# EasyEDA Pro project 单转双芯片.eprj

# Schematic Schematic1
Create Date: 2023-07-18; Page Name: P1; Project Name: 单转双芯片; Schematic Name: Schematic1; Update Date: 2023-07-19; Company: 嘉立创EDA; Page Size: A4; Version: V1.0
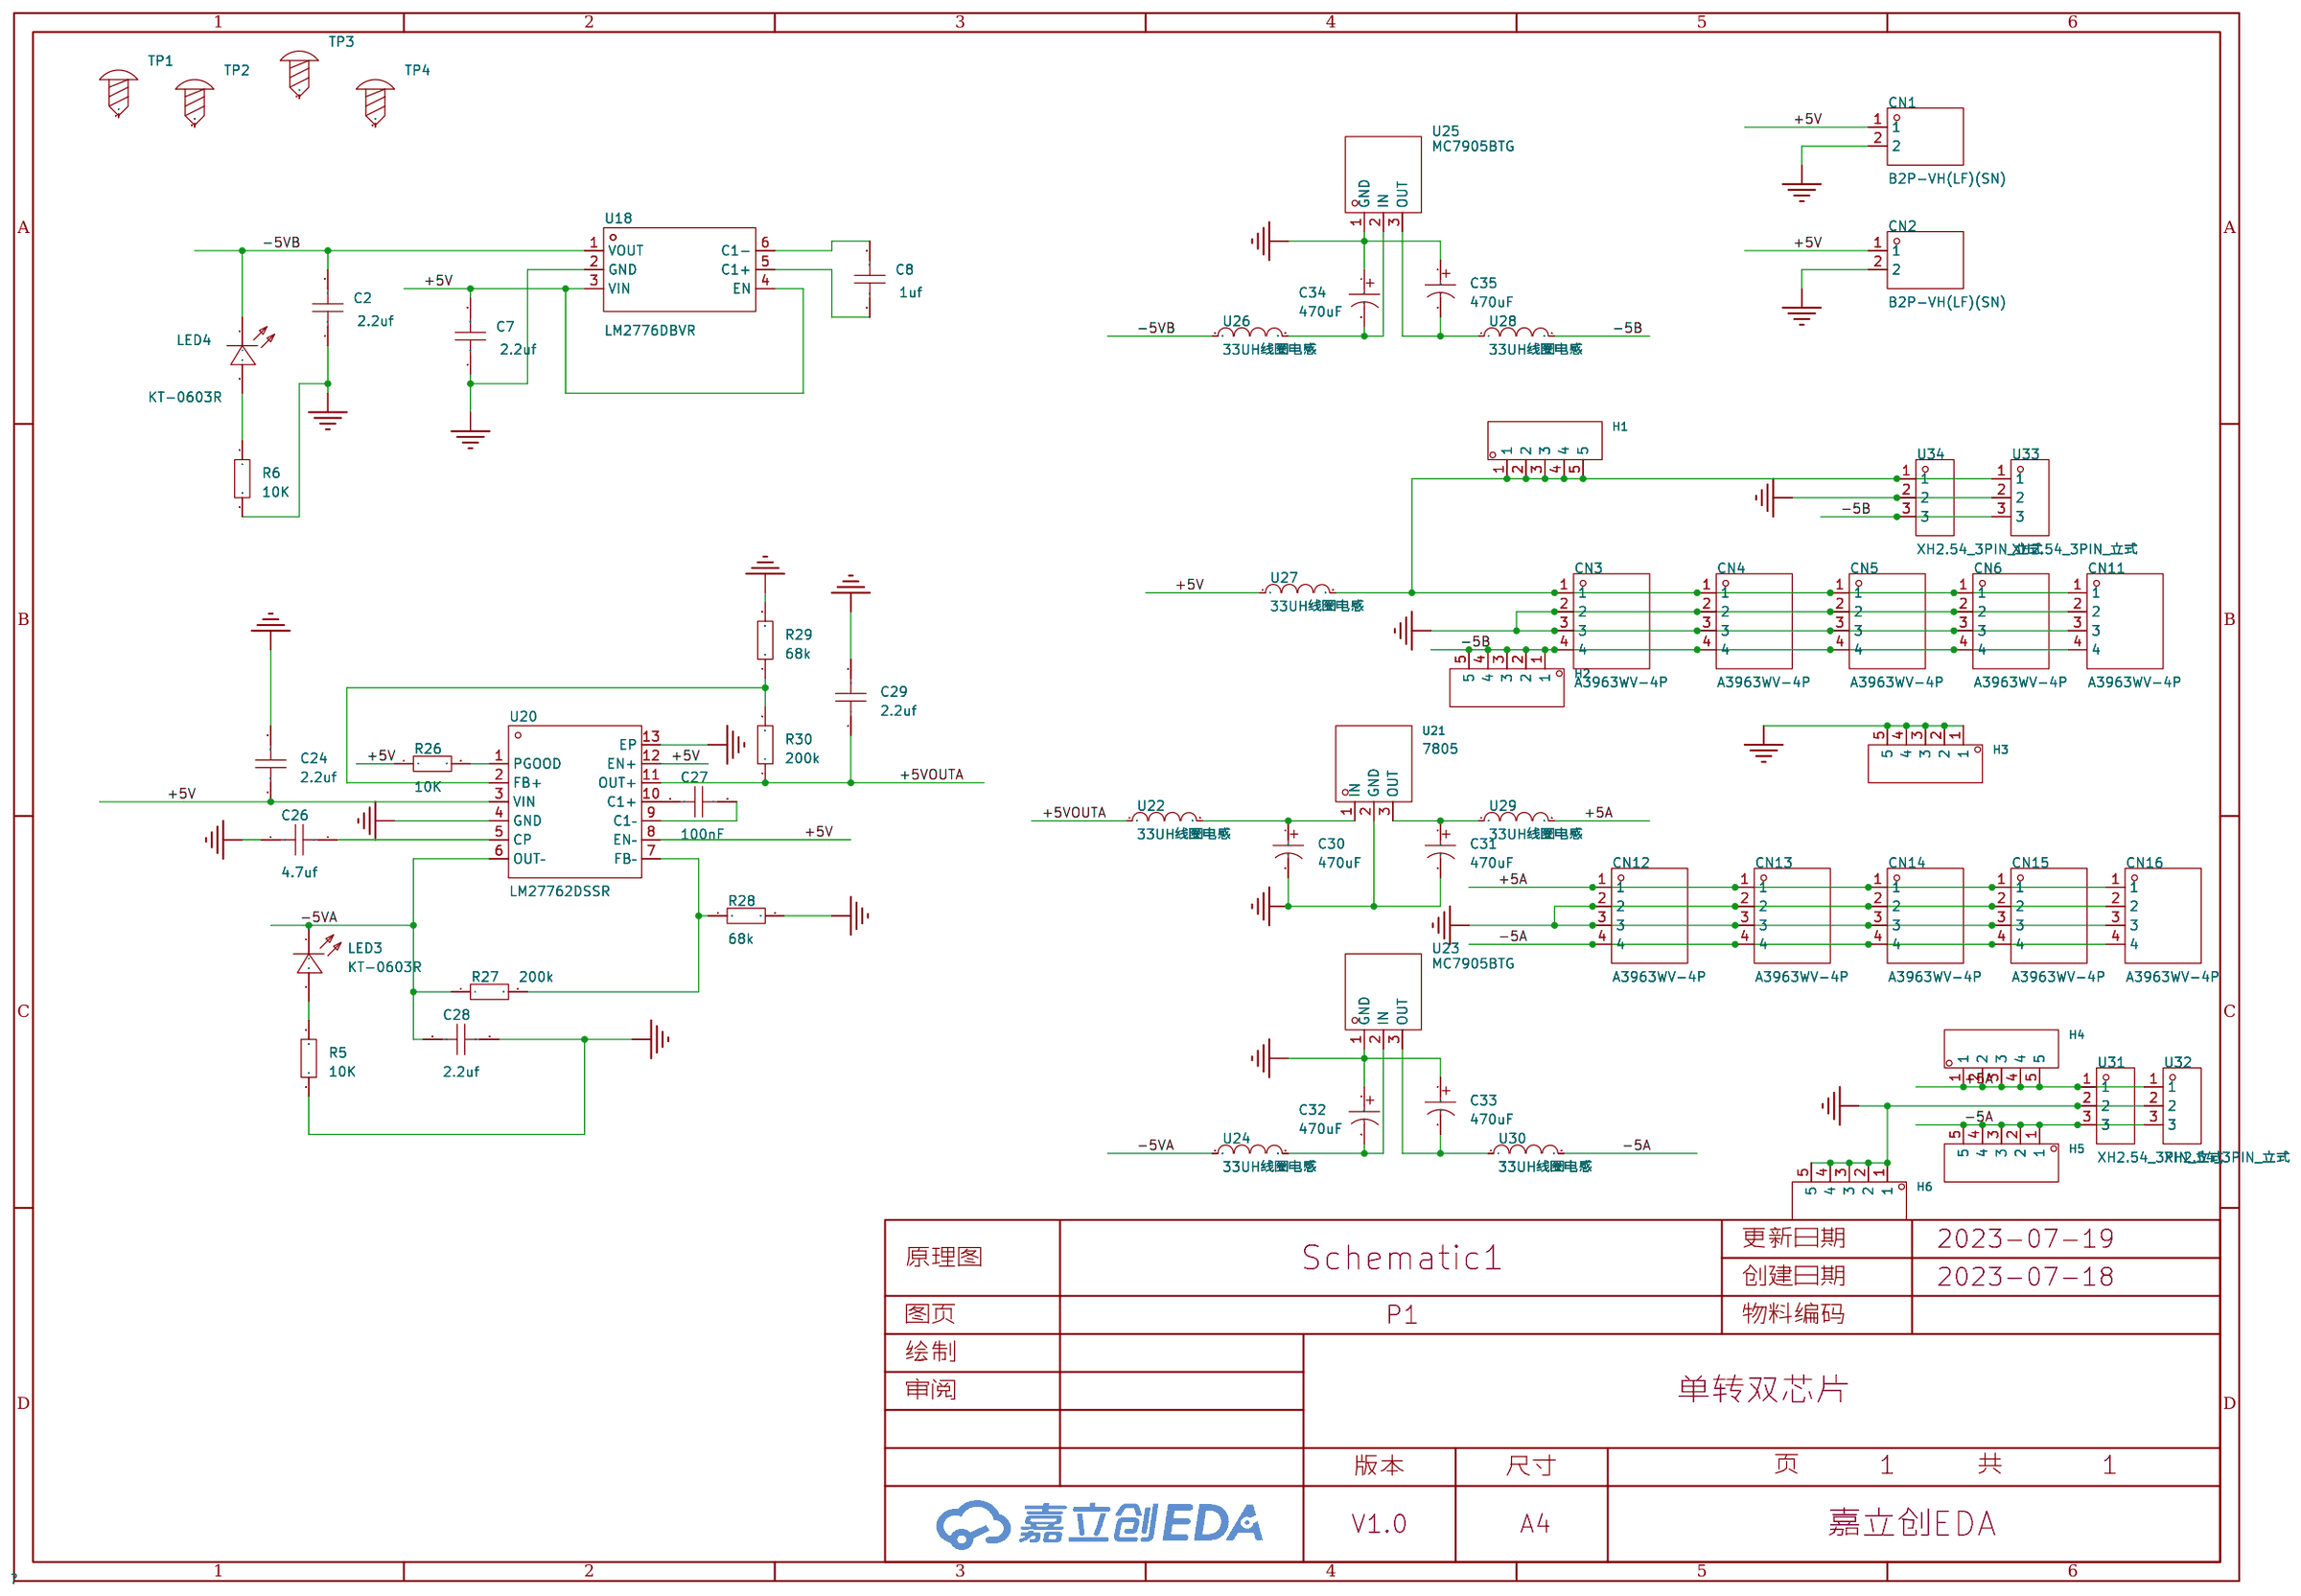
[diagram p0: schematic sheet]

## Parts
C2  2.2uf  [C0603]
C7  2.2uf  [C0603]
C8  1uf  [C0603]
C24  2.2uf  [C0603]
C26  4.7uf  [C0603]
C27  100nF  [C0603]
C28  2.2uf  [C0603]
C29  2.2uf  [C0603]
C30  470uF  [CAP-TH_BD8.0-P3.50-D0.6-FD]
C31  470uF  [CAP-TH_BD8.0-P3.50-D0.6-FD]
C32  470uF  [CAP-TH_BD8.0-P3.50-D0.6-FD]
C33  470uF  [CAP-TH_BD8.0-P3.50-D0.6-FD]
C34  470uF  [CAP-TH_BD8.0-P3.50-D0.6-FD]
C35  470uF  [CAP-TH_BD8.0-P3.50-D0.6-FD]
CN1  B2P-VH(LF)(SN)  [CONN-TH_B2P-VH-LF-SN]
CN2  B2P-VH(LF)(SN)  [CONN-TH_B2P-VH-LF-SN]
CN3  A3963WV-4P  [CONN-TH_A3963WV-4P]
CN4  A3963WV-4P  [CONN-TH_A3963WV-4P]
CN5  A3963WV-4P  [CONN-TH_A3963WV-4P]
CN6  A3963WV-4P  [CONN-TH_A3963WV-4P]
CN11  A3963WV-4P  [CONN-TH_A3963WV-4P]
CN12  A3963WV-4P  [CONN-TH_A3963WV-4P]
CN13  A3963WV-4P  [CONN-TH_A3963WV-4P]
CN14  A3963WV-4P  [CONN-TH_A3963WV-4P]
CN15  A3963WV-4P  [CONN-TH_A3963WV-4P]
CN16  A3963WV-4P  [CONN-TH_A3963WV-4P]
H1  -  [HDR-TH_5P-P2.54-V-M]
H2  -  [HDR-TH_5P-P2.54-V-M]
H3  -  [HDR-TH_5P-P2.54-V-M]
H4  -  [HDR-TH_5P-P2.54-V-M]
H5  -  [HDR-TH_5P-P2.54-V-M]
H6  -  [HDR-TH_5P-P2.54-V-M]
LED3  KT-0603R  [LED0603-RD]
LED4  KT-0603R  [LED0603-RD]
R5  10K  [R0603]
R6  10K  [R0603]
R26  10K  [R0603]
R27  200k  [R0603]
R28  68k  [R0603]
R29  68k  [R0603]
R30  200k  [R0603]
TP1  -  [M3螺丝]
TP2  -  [M3螺丝]
TP3  -  [M3螺丝]
TP4  -  [M3螺丝]
U18  LM2776DBVR  [SOT-23-6_L2.9-W1.6-P0.95-LS2.8-BR]
U20  LM27762DSSR  [WSON-12_L3.0-W2.0-P0.50-BL-EP]
U21  7805  [TO-220-3_L10.2-W4.5-P2.54-L-1]
U22  33UH线圈电感  [IND-TH_L5.4-W5.0]
U23  MC7905BTG  [TO-220-3_L10.0-W4.5-P2.54-T]
U24  33UH线圈电感  [IND-TH_L5.4-W5.0]
U25  MC7905BTG  [TO-220-3_L10.0-W4.5-P2.54-T]
U26  33UH线圈电感  [IND-TH_L5.4-W5.0]
U27  33UH线圈电感  [IND-TH_L5.4-W5.0]
U28  33UH线圈电感  [IND-TH_L5.4-W5.0]
U29  33UH线圈电感  [IND-TH_L5.4-W5.0]
U30  33UH线圈电感  [IND-TH_L5.4-W5.0]
U31  XH2.54_3PIN_立式  [CONN-TH_XH2.54_3PIN]
U32  XH2.54_3PIN_立式  [CONN-TH_XH2.54_3PIN]
U33  XH2.54_3PIN_立式  [CONN-TH_XH2.54_3PIN]
U34  XH2.54_3PIN_立式  [CONN-TH_XH2.54_3PIN]

## Library data of the parts
C2 C7 C8 C24 C26-C29 = CAP_0603: Supplier Footprint: 0603
C30-C35 = 470uF 25V 8*12: 容值:470uF;精度:±20%;额定电压:25V;; LCSC Part Name: 470uF ±20% 25V; Supplier Part: C43839; Manufacturer: CX(承兴); Manufacturer Part: KM477M025F12RR0VH2FP0; Supplier Footprint: 插件,D8xL12mm; JLCPCB Part Class: Extended Part; Datasheet: https://atta.szlcsc.com/upload/public/pdf/source/20211027/06D6BA3719C264B639DC286D935D03EA.pdf; Supplier: LCSC; Tolerance: ±20%; Rated Voltage: 25V; φD: 8mm; L: 12mm; Lead Spacing: 3.5mm; Lifetime @ Temp: 2000hrs@105℃
CN1 CN2 = B2P-VH(LF)(SN): 参考系列:VH;间距:3.96mm;插针结构:1x2P;排数:1;每排PIN数:2;行距:-;安装方式:-;触头材质:黄铜;; LCSC Part Name: VH 3.96mm 1x2P 直插; Supplier Part: C160315; Manufacturer: JST; Supplier Footprint: 插件,P=3.96mm; JLCPCB Part Class: 扩展库; Datasheet: https://atta.szlcsc.com/upload/public/pdf/source/20180420/C160315_19C451141449BB9E1CAF8D49BAD03192.pdf; Supplier: LCSC; Reference Series: VH; Pitch: 3.96mm; Pins Structure: 1x2P; Number of Rows: 1; Number of PINs Per Row: 2; Contact Material: 黄铜
CN3-CN6 CN11-CN16 = A3963WV-4P: 参考系列:VH;间距:3.96mm;插针结构:1x4P;排数:1;每排PIN数:4;行距:-;安装方式:-;触头材质:黄铜;; LCSC Part Name: VH 3.96mm 1x4P; Supplier Part: C239411; Manufacturer: CJT(长江连接器); Supplier Footprint: 直插,P=3.96mm; JLCPCB Part Class: Extended Part; Datasheet: https://atta.szlcsc.com/upload/public/pdf/source/20180725/C239411_2B583D17F8A06D9E72A993AEB9CC7416.pdf; Supplier: LCSC; Reference Series: VH; Pitch: 3.96mm; Pins Structure: 1x4P; Number of Rows: 1; Number of PINs Per Row: 4; Contact Material: 黄铜
H1-H6 = HDR-M_2.54_1x5P: Supplier Part: C358687; Supplier Footprint: 插件
LED3 LED4 = KT-0603R: 发光颜色:红灯;二极管配置:-;透镜颜色:-;主波长:-;色温:-;功率:-;发光角度:-;安装方式:-;工作温度:-40℃~+85℃;; LCSC Part Name: 0603 红灯 高亮; Supplier Part: C2286; Manufacturer: KENTO; Supplier Footprint: 0603; JLCPCB Part Class: 基础库; Datasheet: https://atta.szlcsc.com/upload/public/pdf/source/20160616/1466072038404.pdf; Supplier: LCSC; Emitted Color: 红灯; Operating Temperature: -40℃~+85℃
R5 R6 R26-R30 = Res_0603: Supplier Footprint: 0603
TP1-TP4 = M3螺丝: Supplier Footprint: 插件
U18 = LM2776DBVR: 可输出电流:200mA;开关工作频率:2MHz;输出类型:Fixed;输出电压的路数:1;功能类型:Ratiometric;输出配置:Negative;; Supplier Part: C69527; Manufacturer: TI(德州仪器); Supplier Footprint: SOT-23-6; JLCPCB Part Class: Extended Part; Datasheet: https://atta.szlcsc.com/upload/public/pdf/source/20170908/C69527_1504870089399958035.pdf; Supplier: LCSC
U20 = LM27762DSSR: 功能类型:电荷泵;同步整流:否;输出通道数:2;拓扑结构:-;输入电压:2.7V~5.5V;输出电压:-5V~-1.5V；1.5V~5V;输出电流(最大值):250mA;开关频率:2.3MHz;; LCSC Part Name: 电荷泵 Vin=2.7V~5.5V Vout=1.5V~5V Vout=-5V~-1.5V 250mA; Supplier Part: C473398; Manufacturer: TI(德州仪器); Supplier Footprint: WSON-12; JLCPCB Part Class: 扩展库; Datasheet: https://atta.szlcsc.com/upload/public/pdf/source/20200102/C473398_D2E7C41775171187D808CA6E0151F4D2.pdf; Supplier: LCSC; Function: 电荷泵; Synchronous Rectification: 否; Number of Outputs: 2; Input Voltage: 2.7V~5.5V; Output Voltage: -5V~-1.5V；1.5V~5V; Output Current (Max): 250mA; Switching Frequency: 2.3MHz
U21 = 7805: 输出类型:固定;输出极性:正;最大输入电压:35V;输出电压:5V;输出电流:1.5A;电源纹波抑制比(PSRR):62dB@(120Hz);; LCSC Part Name: 输入35V 输出5V 1.5A; Supplier Part: C4944936; Manufacturer: SY(顺烨）; Supplier Footprint: TO-220AB; JLCPCB Part Class: 扩展库; Datasheet: https://atta.szlcsc.com/upload/public/pdf/source/20220719/323A3F14557C229271C454C7C0F759A5.pdf; Supplier: LCSC; Output Type: 固定; Output Polarity: 正; Maximum Input Voltage: 35V; Output Voltage: 5V; Output Current: 1.5A; Power Supply Rejection Ratio (PSRR): 62dB@(120Hz)
U22 U24 U26-U30 = 33UH线圈电感: Supplier Part: C9900014722; Supplier Footprint: DIP-LH-2P-12*6MM; JLCPCB Part Class: 扩展库; Datasheet: https://atta.szlcsc.comnull; Supplier: LCSC
U23 U25 = MC7905BTG: 输出类型:固定;输出极性:负;最大输入电压:35V;输出电压:5V;输出电流:1A;电源纹波抑制比(PSRR):70dB@(120Hz);; LCSC Part Name: 输入35V 输出5V 1A; Supplier Part: C153066; Manufacturer: onsemi(安森美); Supplier Footprint: TO-220; JLCPCB Part Class: 扩展库; Datasheet: https://atta.szlcsc.com/upload/public/pdf/source/20171221/C153066_15138394766691195791.PDF; Supplier: LCSC; Output Type: 固定; Output Polarity: 负; Number of Outputs: 1; Maximum Input Voltage: 35V; Output Voltage: 5V; Dropout Voltage: 1.3V@(1A); Output Current: 1A; Power Supply Rejection Ratio (PSRR): 70dB@(120Hz); Operating Temperature: -40℃~+125℃
U31-U34 = XH2.54_3PIN_立式: Supplier Part: C9900001961; Supplier Footprint: CONN-TH_3P-P2.54-L10.0-W5.8; JLCPCB Part Class: 扩展库; Datasheet: 2021-11-15/732541S/0c8180f3a8954d56be60ffcaf2ae9190/MAX6071_cn.pdf; Supplier: LCSC

## Nets
+5V: C7.2 C24.1 CN1.1 CN2.1 R26.1 U18.3(VIN) U18.4(EN) U20.3(VIN) U20.8(EN–) U20.12(EN+) U27.1
+5VOUTA: C29.1 R30.1 U20.11(OUT+) U22.1
-5VA: C28.2 LED3.1(K) R27.1 U20.6(OUT–) U24.1
-5VB: C2.2 LED4.1(K) U18.1(VOUT) U26.1
GND: C2.1 C7.1 C24.2 C26.2 C28.1 C29.2 C30.2 C31.2 C32.1 C33.1 C34.1 C35.1 CN1.2 CN2.2 CN3.2 CN3.3 CN4.2 CN4.3 CN5.2 CN5.3 CN6.2 CN6.3 CN11.2 CN11.3 CN12.2 CN12.3 CN13.2 CN13.3 CN14.2 CN14.3 CN15.2 CN15.3 CN16.2 CN16.3 H3.1 H3.2 H3.3 H3.4 H3.5 H6.1 H6.2 H6.3 H6.4 H6.5 R5.2 R6.2 R28.2 R29.2 U18.2(GND) U20.4(GND) U20.13(EP) U21.2(GND) U23.1(GND) U25.1(GND) U31.2 U32.2 U33.2 U34.2
+5A: CN12.1 CN13.1 CN14.1 CN15.1 CN16.1 H4.1 H4.2 H4.3 H4.4 H4.5 U29.2 U31.1 U32.1
-5A: CN12.4 CN13.4 CN14.4 CN15.4 CN16.4 H5.1 H5.2 H5.3 H5.4 H5.5 U30.2 U31.3 U32.3
-5B: CN3.4 CN4.4 CN5.4 CN6.4 CN11.4 H2.1 H2.2 H2.3 H2.4 H2.5 U28.2 U33.3 U34.3
$1N236: C8.1 U18.5(C1+)
$1N237: C8.2 U18.6(C1-)
$1N242: LED4.2(A) R6.1
$1N715: C26.1 U20.5(CP)
$1N716: C27.1 U20.10(C1+)
$1N717: C27.2 U20.9(C1–)
$1N728: R29.1 R30.2 U20.2(FB+)
$1N729: R26.2 U20.1(PGOOD)
$1N734: R27.2 R28.1 U20.7(FB–)
$1N740: LED3.2(A) R5.1
$1N844: C30.1 U21.1(IN) U22.2
$1N1353: C32.2 U23.2(IN) U24.2
$1N1533: C34.2 U25.2(IN) U26.2
$1N3122: C35.2 U25.3(OUT) U28.1
$1N3165: C31.1 U21.3(OUT) U29.1
$1N3204: C33.2 U23.3(OUT) U30.1
Net-(CN3-1): CN3.1 CN4.1 CN5.1 CN6.1 CN11.1 H1.1 H1.2 H1.3 H1.4 H1.5 U27.2 U33.1 U34.1

Not connected (* = marked no-connect by the designer): TP1 1; TP2 1; TP3 1; TP4 1

# Board PCB1
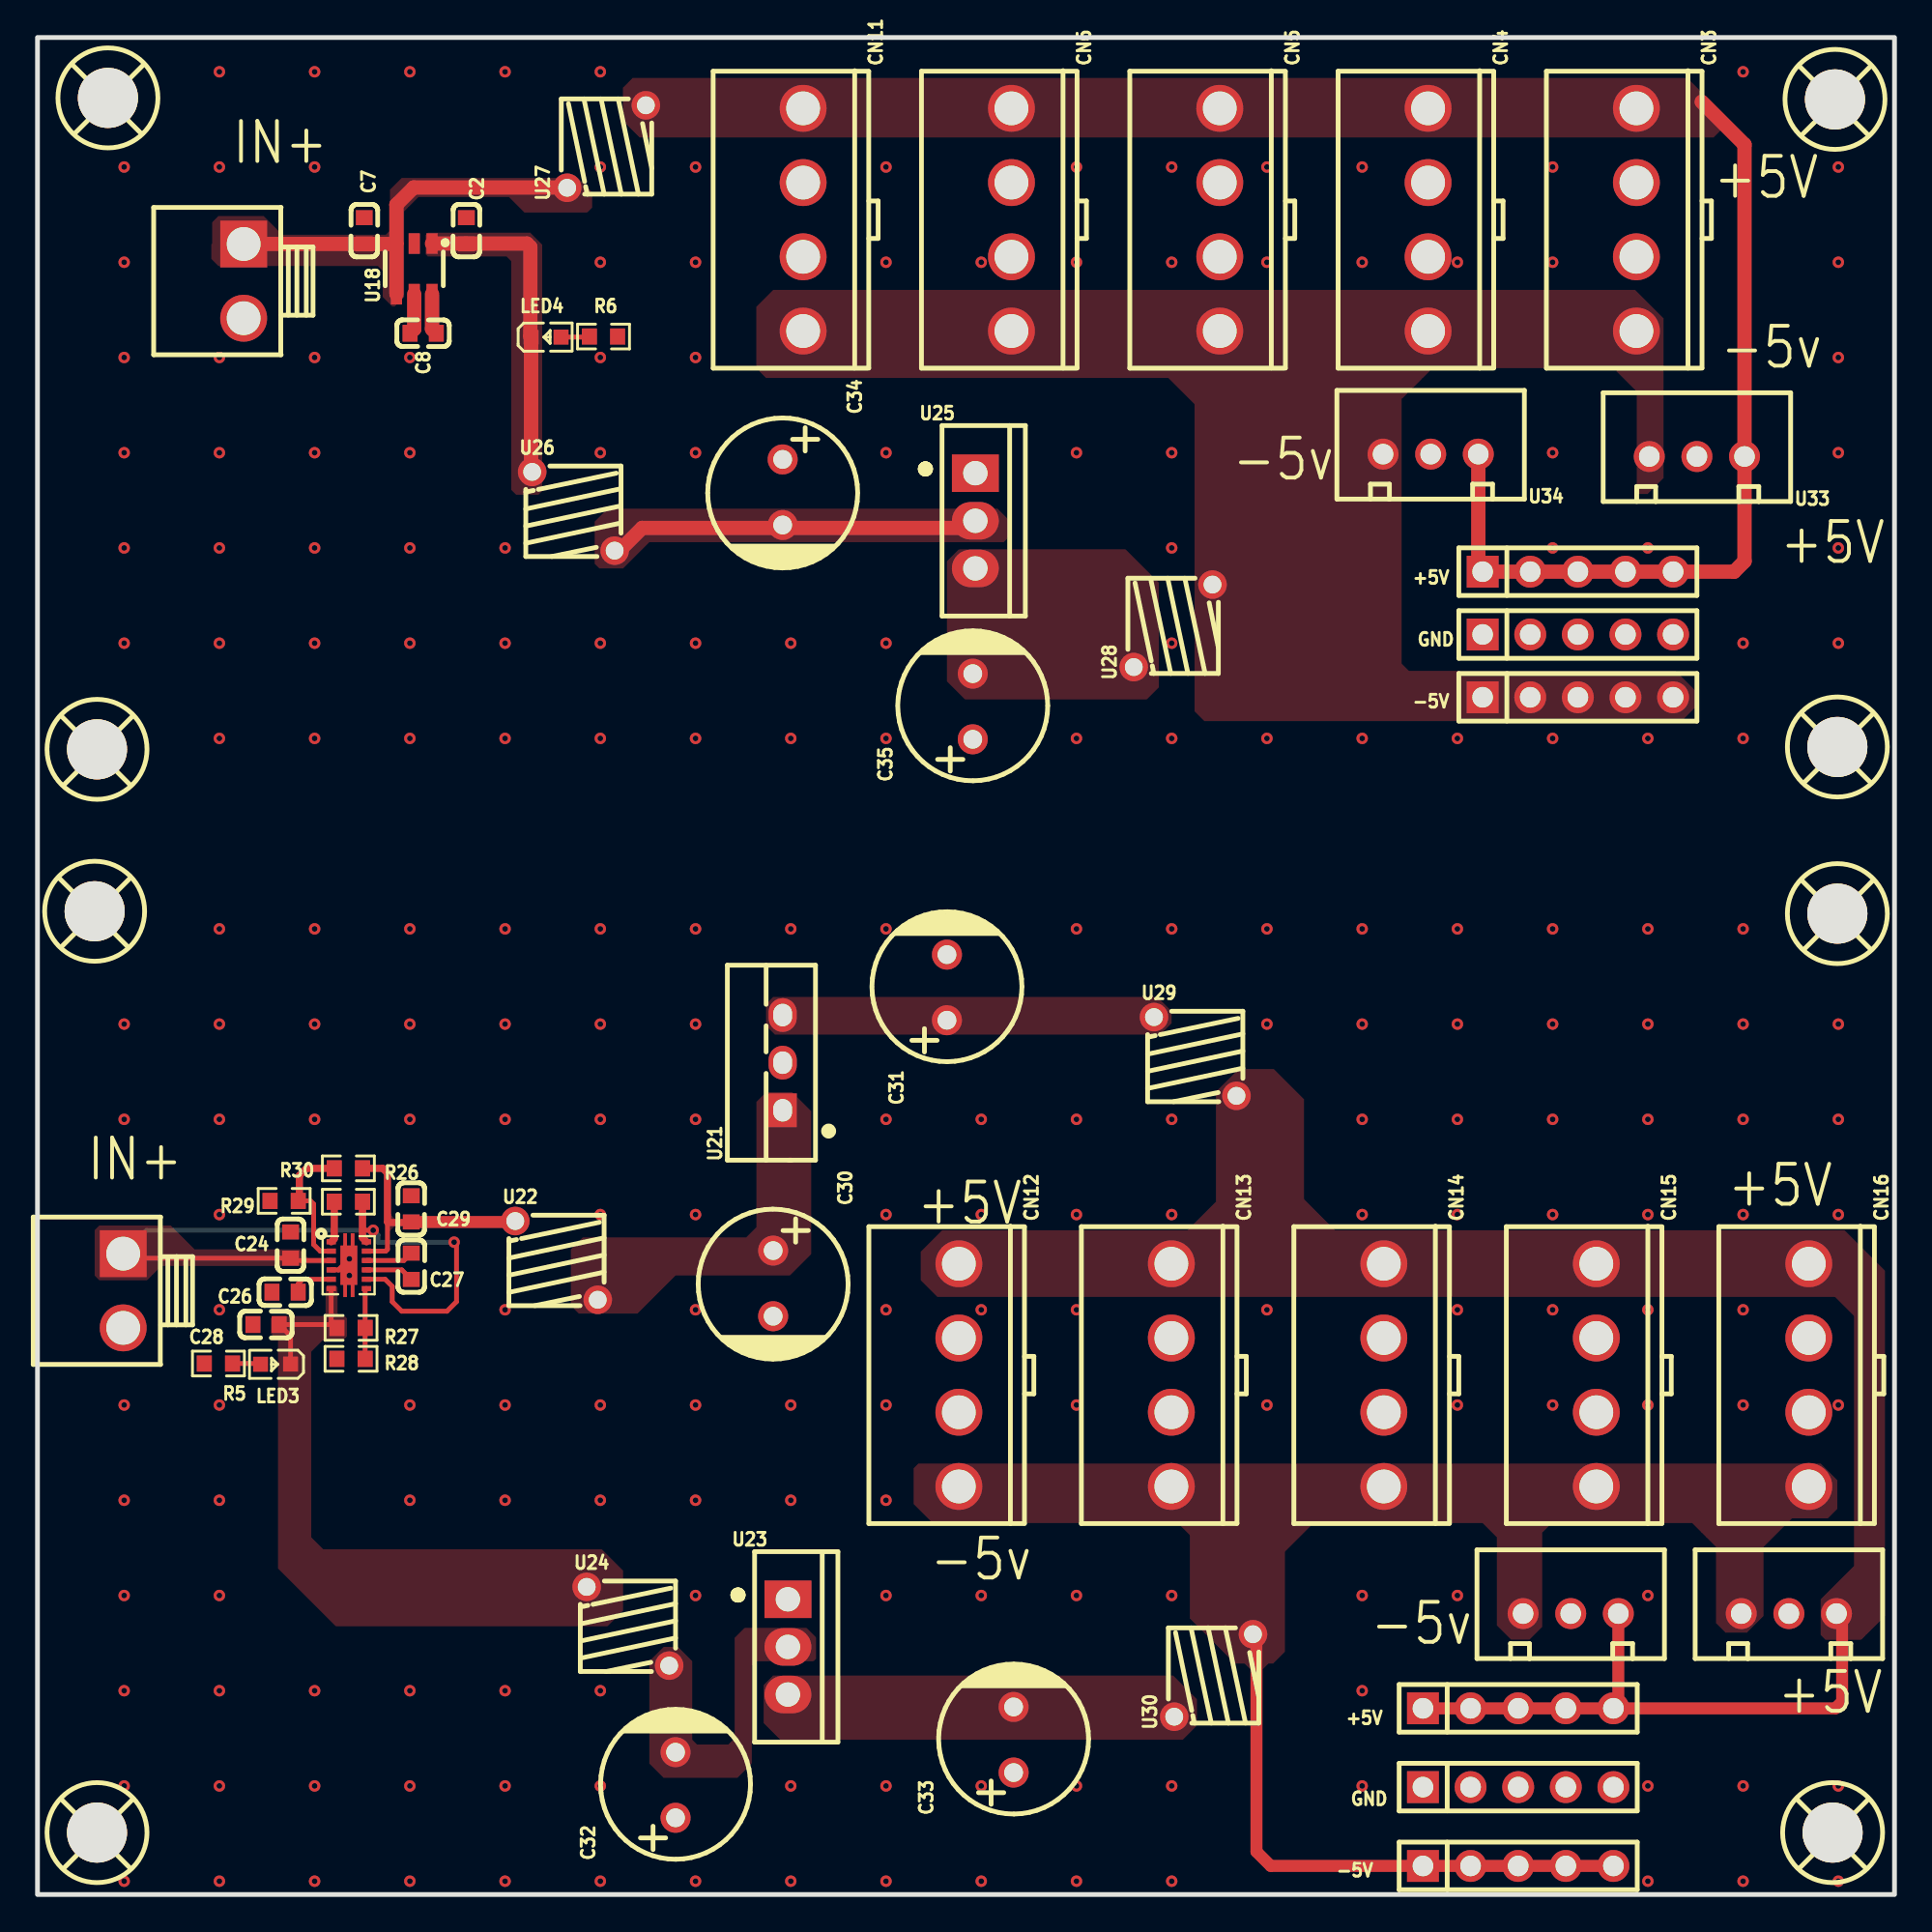
[diagram p1: board, top side]
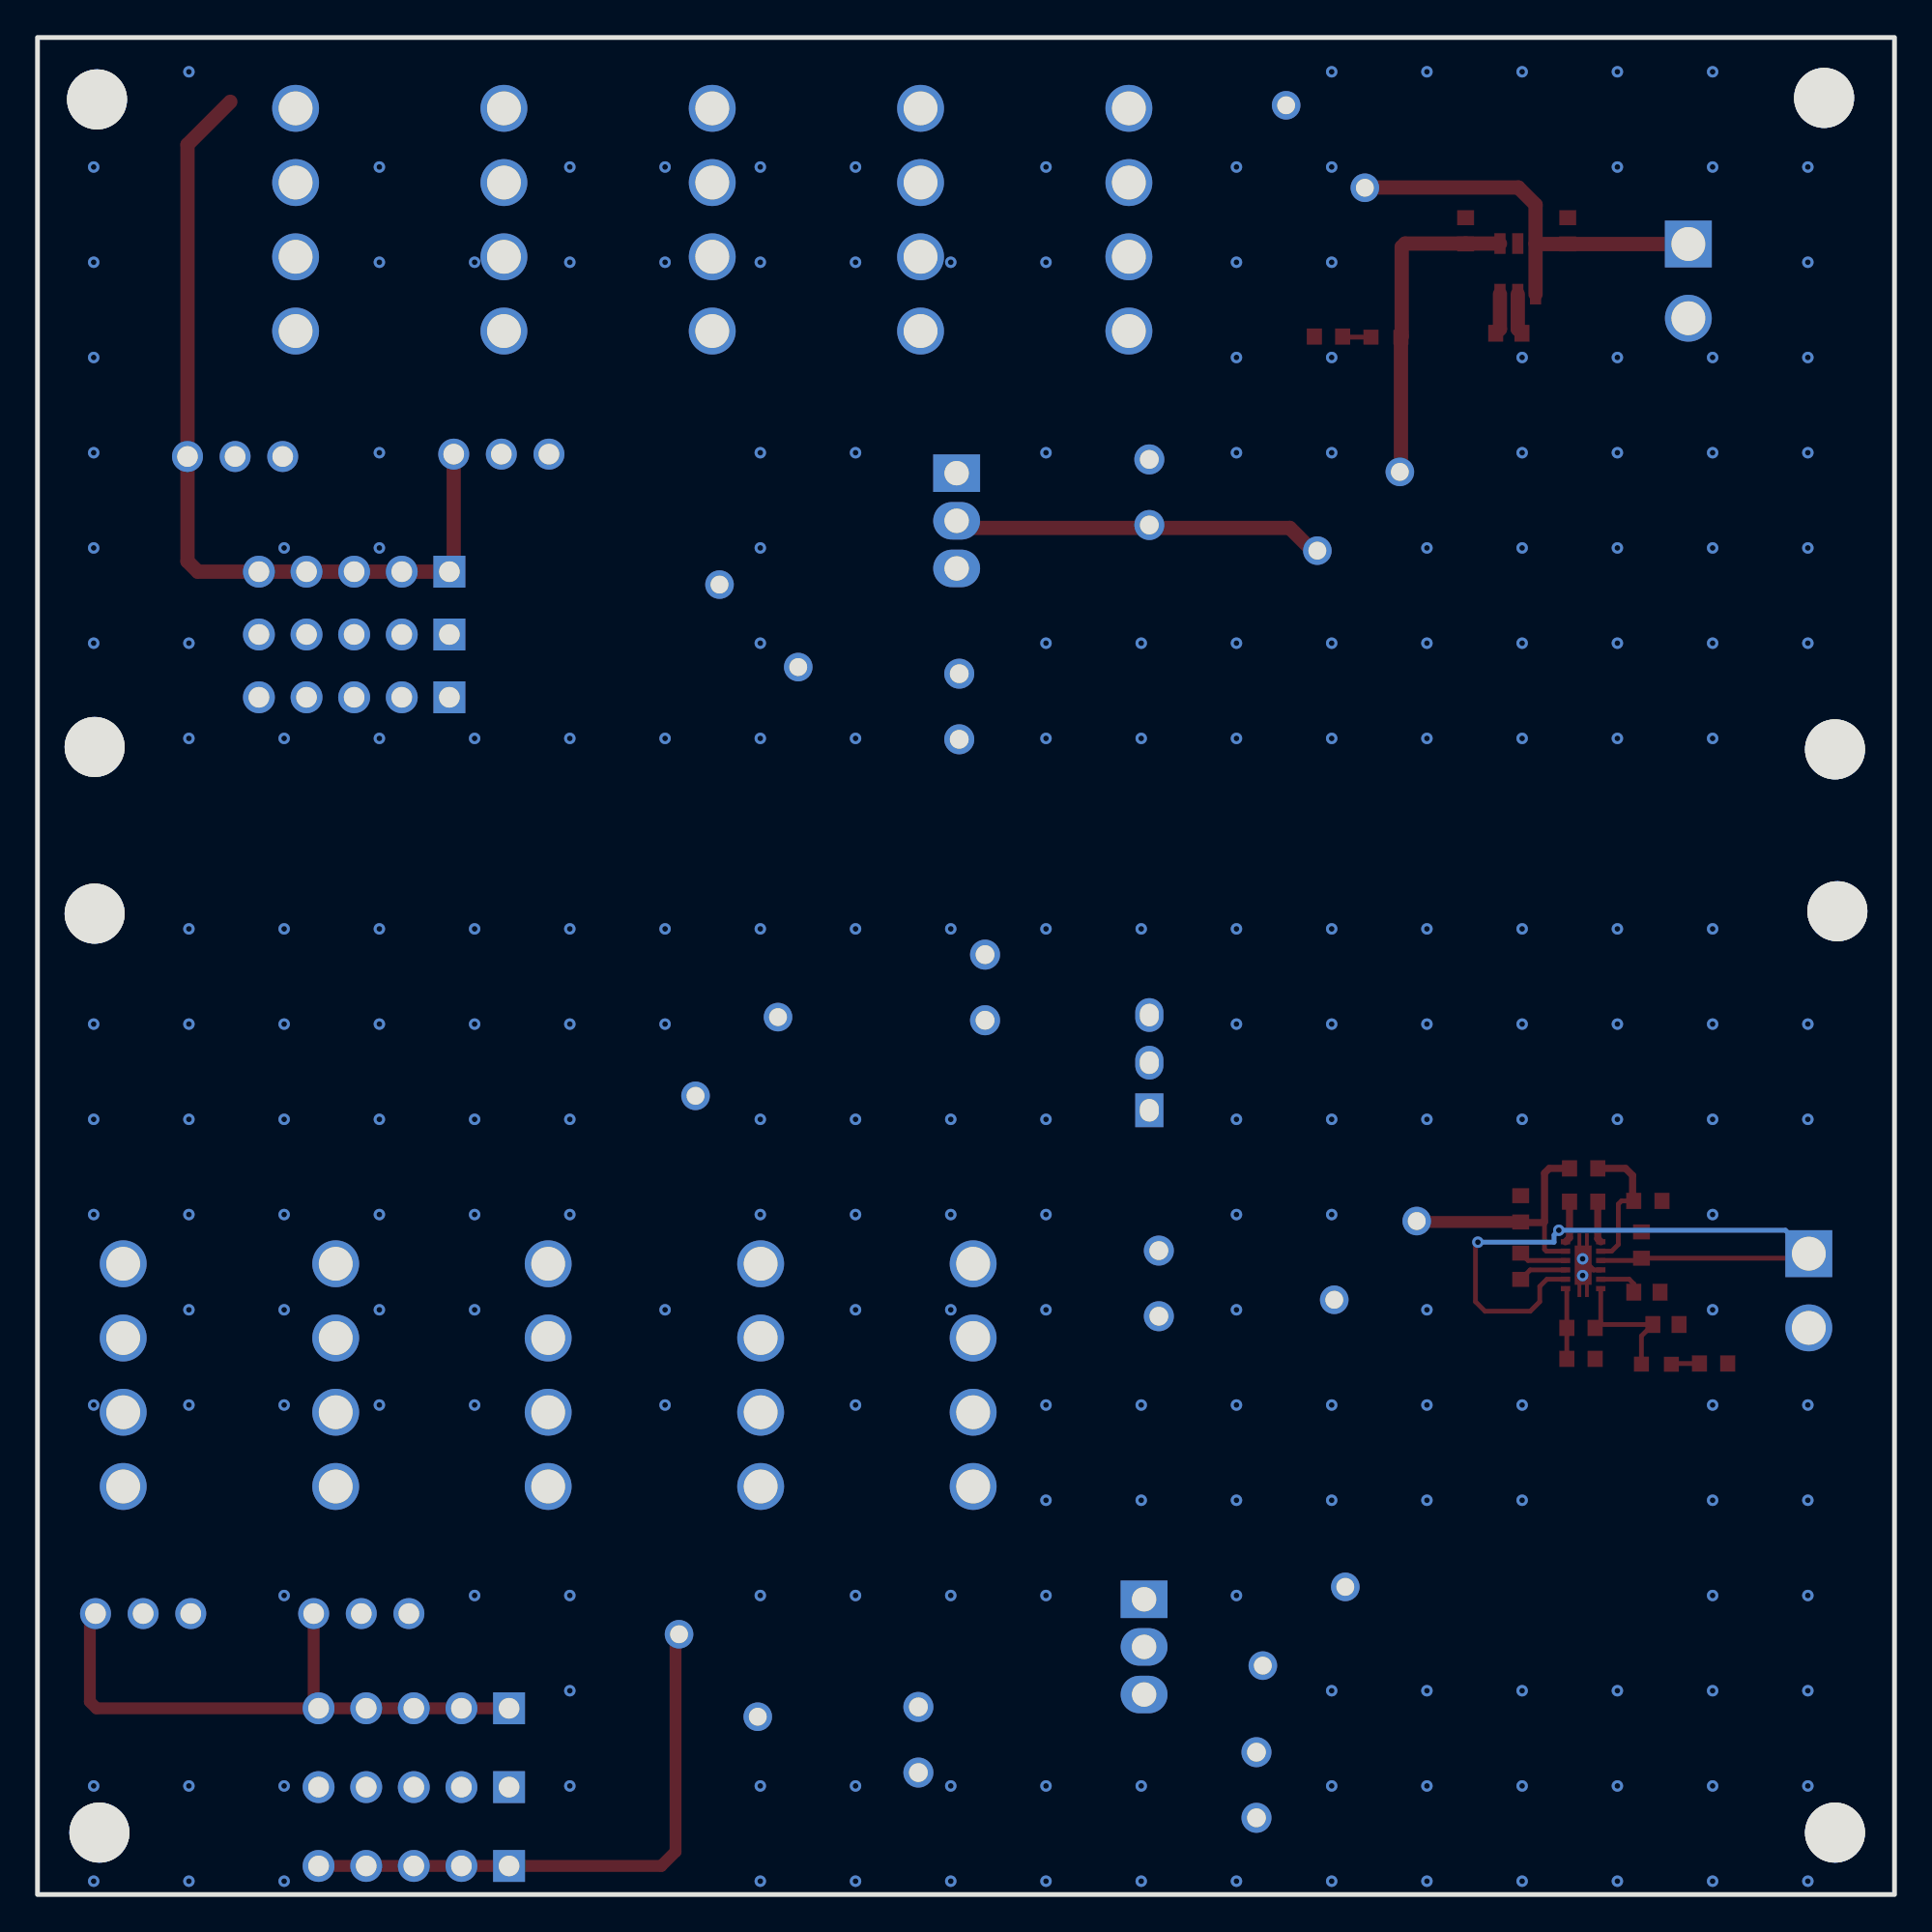
[diagram p2: board, bottom side, seen from below]

Outline 99.06 x 99.06 mm; copper layers: Top Layer, Bottom Layer. Coordinates in mm from the lower left corner of the outline.
Outline path: rectangle 0,99.06 99.06,0
Stack: Top Layer 0.035mm / Dielectric1 1.51mm FR4 er 4.5 / Bottom Layer 0.035mm

## Design rules (mm)
template: JLCPCB Capability(Two Layers Board)
spacing copperThickness1oz (default): track to track 0.102, other pairs 0.152 to 0.3
spacing copperThickness2oz: track to track 0.203, other pairs 0.152 to 0.3
track width copperThickness1oz (default): min 0.127, default 0.254, max 2.54
track width copperThickness2oz: min 0.203, default 0.254, max 2.54
differential pair differentialPair (default): width min 0.127, default 0.254, max 2.54; gap min 0.152, default 0.152
via viaSize (default): diameter min 0.5, default 0.61, max 10; hole min 0.3, default 0.305, max 6.3

## Placement (name value [footprint] x y rotation side)
+5V  -  [HDR-TH_5P-P2.54-V-M]  82.17 70.57 0 top
+5V#2  -  [HDR-TH_5P-P2.54-V-M]  78.99 9.93 0 top
-5V  -  [HDR-TH_5P-P2.54-V-M]  82.17 63.86 0 top
-5V#2  -  [HDR-TH_5P-P2.54-V-M]  78.99 1.52 0 top
C2  2.2uf  [C0603]  22.88 88.75 270 top
C7  2.2uf  [C0603]  17.43 88.75 270 top
C8  1uf  [C0603]  20.57 83.28 0 top
C24  2.2uf  [C0603]  13.5 34.64 90 top
C26  4.7uf  [C0603]  13.21 32.13 180 top
C27  100nF  [C0603]  19.94 33.51 270 top
C28  2.2uf  [C0603]  12.19 30.4 0 top
C29  2.2uf  [C0603]  19.94 36.58 90 top
C30  470uF  [CAP-TH_BD8.0-P3.50-D0.6-FD]  39.24 32.6 270 top
C31  470uF  [CAP-TH_BD8.0-P3.50-D0.6-FD]  48.51 48.39 90 top
C32  470uF  [CAP-TH_BD8.0-P3.50-D0.6-FD]  34.04 5.84 90 top
C33  470uF  [CAP-TH_BD8.0-P3.50-D0.6-FD]  52.07 8.25 90 top
C34  470uF  [CAP-TH_BD8.0-P3.50-D0.6-FD]  39.75 74.8 270 top
C35  470uF  [CAP-TH_BD8.0-P3.50-D0.6-FD]  49.89 63.37 90 top
CN1  B2P-VH(LF)(SN)  [CONN-TH_B2P-VH-LF-SN]  4.57 32.21 270 top
CN2  B2P-VH(LF)(SN)  [CONN-TH_B2P-VH-LF-SN]  11 86.06 270 top
CN3  A3963WV-4P  [CONN-TH_A3963WV-4P]  85.29 89.34 270 top
CN4  A3963WV-4P  [CONN-TH_A3963WV-4P]  74.18 89.34 270 top
CN5  A3963WV-4P  [CONN-TH_A3963WV-4P]  63.07 89.34 270 top
CN6  A3963WV-4P  [CONN-TH_A3963WV-4P]  51.95 89.34 270 top
CN11  A3963WV-4P  [CONN-TH_A3963WV-4P]  40.84 89.34 270 top
CN12  A3963WV-4P  [CONN-TH_A3963WV-4P]  49.15 27.71 270 top
CN13  A3963WV-4P  [CONN-TH_A3963WV-4P]  60.48 27.71 270 top
CN14  A3963WV-4P  [CONN-TH_A3963WV-4P]  71.82 27.71 270 top
CN15  A3963WV-4P  [CONN-TH_A3963WV-4P]  83.15 27.71 270 top
CN16  A3963WV-4P  [CONN-TH_A3963WV-4P]  94.49 27.71 270 top
GND  -  [HDR-TH_5P-P2.54-V-M]  82.17 67.21 0 top
GND#2  -  [HDR-TH_5P-P2.54-V-M]  78.99 5.73 0 top
LED3  KT-0603R  [LED0603-RD]  12.7 28.29 180 top
LED4  KT-0603R  [LED0603-RD]  27.13 83.07 0 top
R5  10K  [R0603]  9.65 28.32 180 top
R6  10K  [R0603]  30.19 83.11 0 top
R26  10K  [R0603]  16.58 36.96 180 top
R27  200k  [R0603]  16.72 30.23 0 top
R28  68k  [R0603]  16.72 28.58 180 top
R29  68k  [R0603]  13.16 37 180 top
R30  200k  [R0603]  16.58 38.74 180 top
TP4  -  [M3螺丝]  3.24 3.24 0 top
TP4#2  -  [M3螺丝]  3.82 95.77 0 top
TP4#3  -  [M3螺丝]  95.82 3.24 0 top
TP4#4  -  [M3螺丝]  95.95 95.69 0 top
TP4#5  -  [M3螺丝]  96.08 61.15 0 top
TP4#6  -  [M3螺丝]  96.08 52.26 0 top
TP4#7  -  [M3螺丝]  3.11 52.39 0 top
TP4#8  -  [M3螺丝]  3.24 61.02 0 top
U18  LM2776DBVR  [SOT-23-6_L2.9-W1.6-P0.95-LS2.8-BR]  20.1 86.72 90 top
U20  LM27762DSSR  [WSON-12_L3.0-W2.0-P0.50-BL-EP]  16.61 33.57 270 top
U21  7805  [TO-220-3_L10.2-W4.5-P2.54-L-1]  39.75 44.37 90 top
U22  33UH线圈电感  [IND-TH_L5.4-W5.0]  27.69 33.83 0 top
U23  MC7905BTG  [TO-220-3_L10.0-W4.5-P2.54-T]  40.03 13.21 0 top
U24  33UH线圈电感  [IND-TH_L5.4-W5.0]  31.5 14.31 0 top
U25  MC7905BTG  [TO-220-3_L10.0-W4.5-P2.54-T]  50.03 73.28 0 top
U26  33UH线圈电感  [IND-TH_L5.4-W5.0]  28.59 73.79 0 top
U27  33UH线圈电感  [IND-TH_L5.4-W5.0]  30.35 93.24 90 top
U28  33UH线圈电感  [IND-TH_L5.4-W5.0]  60.58 67.68 90 top
U29  33UH线圈电感  [IND-TH_L5.4-W5.0]  61.76 44.7 0 top
U30  33UH线圈电感  [IND-TH_L5.4-W5.0]  62.74 11.68 90 top
U31  XH2.54_3PIN_立式  [CONN-TH_XH2.54_3PIN]  81.79 14.99 180 top
U32  XH2.54_3PIN_立式  [CONN-TH_XH2.54_3PIN]  93.42 14.99 180 top
U33  XH2.54_3PIN_立式  [CONN-TH_XH2.54_3PIN]  88.52 76.71 180 top
U34  XH2.54_3PIN_立式  [CONN-TH_XH2.54_3PIN]  74.32 76.84 180 top

## Footprints (pads in the part's own frame, mm; a bottom-side part is the same pattern mirrored in y, then rotated)
C0603
  rect 0.8x0.9 smd: 1(-0.7,0) 2(0.7,0)
CAP-TH_BD8.0-P3.50-D0.6-FD
  round 1.6 hole 1: 1(-1.75,0) 2(1.75,0)
CONN-TH_A3963WV-4P
  round 2.5 hole 1.8: 1(-5.94,0) 2(-1.98,0) 3(1.98,0) 4(5.94,0)
CONN-TH_B2P-VH-LF-SN
  rect 2.5x2.5 hole 1.8: 1(-1.98,0)
  round 2.5 hole 1.8: 2(1.98,0)
CONN-TH_XH2.54_3PIN
  round 1.65 hole 1.1: 1(-2.54,0) 2(0,0) 3(2.54,0)
HDR-TH_5P-P2.54-V-M
  rect 1.7x1.7 hole 1.1: 1(-5.08,0)
  round 1.7 hole 1.1: 2(-2.54,0) 3(0,0) 4(2.54,0) 5(5.08,0)
IND-TH_L5.4-W5.0
  round 1.524 hole 0.95: 1(-2.2,2.1) 2(2.2,-2.1)
LED0603-RD
  rect 0.8x0.8 smd: 1(-0.799,-0.004) 2(0.799,0.004)
M3螺丝
  round 3.2 hole 3.2: 1(-0.064,0.064)
R0603
  rect 0.806x0.864 smd: 1(-0.753,0) 2(0.753,0)
SOT-23-6_L2.9-W1.6-P0.95-LS2.8-BR
  rect 1.1x0.6 smd: 1(1.35,-0.95) 2(1.35,0) 3(1.35,0.95) 4(-1.35,0.95) 5(-1.35,0) 6(-1.35,-0.95)
TO-220-3_L10.0-W4.5-P2.54-T
  rect 2.5x2 hole 1.3: 1(0,2.54)
  oval 2.5x2 hole 1.3: 2(0,0) 3(0,-2.54)
TO-220-3_L10.2-W4.5-P2.54-L-1
  rect 1.8x1.5 hole 1.2x1: 1(-2.54,0)
  oval 1.8x1.5 hole 1.2x1: 2(0,0) 3(2.54,0)
WSON-12_L3.0-W2.0-P0.50-BL-EP
  rect 0.28x0.5 smd: 1(-1.25,-0.94) 2(-0.75,-0.94) 3(-0.25,-0.94) 4(0.25,-0.94) 5(0.75,-0.94) 6(1.25,-0.94) 7(1.25,0.94) 8(0.75,0.94) 9(0.25,0.94) 10(-0.25,0.94) 11(-0.75,0.94) 12(-1.25,0.94)
  custom 3.4x0.9 smd: 13(0,0)

## Nets
As in the schematic, except:
GND: C2.1 C7.1 C24.2 C26.2 C28.1 C29.2 C30.2 C31.2 C32.1 C33.1 C34.1 C35.1 CN1.2 CN2.2 CN3.2 CN3.3 CN4.2 CN4.3 CN5.2 CN5.3 CN6.2 CN6.3 CN11.2 CN11.3 CN12.2 CN12.3 CN13.2 CN13.3 CN14.2 CN14.3 CN15.2 CN15.3 CN16.2 CN16.3 GND.1 GND.2 GND.3 GND.4 GND.5 GND#2.1 GND#2.2 GND#2.3 GND#2.4 GND#2.5 R5.2 R6.2 R28.2 R29.2 U18.2 U20.4 U20.13 U21.2 U23.1 U25.1 U31.2 U32.2 U33.2 U34.2
+5A: +5V#2.1 +5V#2.2 +5V#2.3 +5V#2.4 +5V#2.5 CN12.1 CN13.1 CN14.1 CN15.1 CN16.1 U29.2 U31.1 U32.1
-5A: -5V#2.1 -5V#2.2 -5V#2.3 -5V#2.4 -5V#2.5 CN12.4 CN13.4 CN14.4 CN15.4 CN16.4 U30.2 U31.3 U32.3
-5B: -5V.1 -5V.2 -5V.3 -5V.4 -5V.5 CN3.4 CN4.4 CN5.4 CN6.4 CN11.4 U28.2 U33.3 U34.3
$1N2930: +5V.1 +5V.2 +5V.3 +5V.4 +5V.5 CN3.1 CN4.1 CN5.1 CN6.1 CN11.1 U27.2 U33.1 U34.1

Pads without a net: TP4 1; TP4#2 1; TP4#3 1; TP4#4 1; TP4#5 1; TP4#6 1; TP4#7 1; TP4#8 1

## Via types
v1: diameter 0.61, hole 0.305, Top Layer to Bottom Layer, 231 vias

## Routing (per net, layer and track width the routed paths; a pad name or vN(x,y) marks a point on that pad's centre or on a via; arc(x,y) is an arc through that point)
+5V: length 64.6
  Top Layer w0.254: U20.8 18.54,32.82 18.92,32.44 18.92,31.62 19.43,31.12 21.84,31.12 22.35,31.62 22.35,34.67 v1(22.22,34.8) ; 17.34,35.43 17.34,35.43 v1(17.91,35.43) ; CN1.1 4.81,33.94 C24.1 13.62,33.82 U20.3
  Top Layer w0.381: R26.1 17.34,35.03 U20.12
  Top Layer w0.762: CN2.1 19.12,88.04 U18.3 ; U18.3 19.15,90.14 20.07,91.06 28.24,91.06 U27.1 ; U18.3 U18.4
  Bottom Layer w0.254: v1(22.22,34.8) 18.16,34.8 18.16,35.18 v1(17.91,35.43) 5.82,35.43 CN1.1
+5VOUTA: length 13.5
  Top Layer w0.254: 18.67,35.88 18.67,34.42 18.57,34.32 U20.11
  Top Layer w0.381: R30.1 18.41,38.74 18.67,38.48 18.67,35.88 18.71,35.85 19.91,35.85 C29.1
  Top Layer w0.635: C29.1 25.44,35.88 25.49,35.93
-5VA: length 7.5
  Top Layer w0.254: 15.79,30.4 15.67,30.53 U20.6 ; 15.79,30.4 C28.2 13.5,29.8 LED3.1 ; 15.79,30.4 R27.1
-5VB: length 17.4
  Top Layer w0.762: 22.86,88.07 U18.1 ; 22.86,88.07 C2.2 ; 22.86,88.07 26.11,88.07 26.29,87.88 26.29,83.11 LED4.1 26.33,76.08 26.13,75.89
GND: length 2.4
  Top Layer w0.254: v1(16.64,33.02) 16.64,33.54 U20.13 16.36,33.32 16.05,33.32 ; 16.05,33.32 U20.4 ; 16.05,33.32 v1(16.64,33.91)
  vias: v1(4.62,92.15) v1(4.62,87.07) v1(4.62,81.99) v1(4.62,76.91) v1(4.62,71.83) v1(4.62,66.75) v1(4.62,46.43) v1(4.62,41.35) v1(4.62,26.11) v1(4.62,21.03) v1(4.62,15.95) v1(4.62,10.87) v1(4.62,5.79) v1(4.62,0.71) v1(9.7,97.23) v1(9.7,92.15) v1(9.7,81.99) v1(9.7,76.91) v1(9.7,71.83) v1(9.7,66.75) v1(9.7,61.67) v1(9.7,51.51) v1(9.7,46.43) v1(9.7,41.35) v1(9.7,36.27) v1(9.7,31.19) v1(9.7,26.11) v1(9.7,21.03) v1(9.7,15.95) v1(9.7,10.87) v1(9.7,5.79) v1(9.7,0.71) v1(14.78,97.23) v1(14.78,92.15) v1(14.78,81.99) v1(14.78,76.91) v1(14.78,71.83) v1(14.78,66.75) v1(14.78,61.67) v1(14.78,51.51) v1(14.78,46.43) v1(14.78,41.35) v1(14.78,10.87) v1(14.78,5.79) v1(14.78,0.71) v1(19.86,97.23) v1(19.86,81.99) v1(19.86,76.91) v1(19.86,71.83) v1(19.86,66.75) v1(19.86,61.67) v1(19.86,51.51) v1(19.86,46.43) v1(19.86,41.35) v1(19.86,26.11) v1(19.86,21.03) v1(19.86,10.87) v1(19.86,5.79) v1(19.86,0.71) v1(24.94,97.23) v1(24.94,71.83) v1(24.94,66.75) v1(24.94,61.67) v1(24.94,51.51) v1(24.94,46.43) v1(24.94,41.35) v1(24.94,31.19) v1(24.94,26.11) v1(24.94,21.03) v1(24.94,10.87) v1(24.94,5.79) v1(24.94,0.71) v1(30.02,97.23) v1(30.02,92.15) v1(30.02,87.07) v1(30.02,81.99) v1(30.02,76.91) v1(30.02,66.75) v1(30.02,61.67) v1(30.02,51.51) v1(30.02,46.43) v1(30.02,41.35) v1(30.02,36.27) v1(30.02,26.11) v1(30.02,21.03) v1(30.02,10.87) v1(30.02,5.79) v1(30.02,0.71) v1(35.1,92.15) v1(35.1,87.07) v1(35.1,81.99) v1(35.1,76.91) v1(35.1,66.75) v1(35.1,61.67) v1(35.1,51.51) v1(35.1,46.43) v1(35.1,41.35) v1(35.1,36.27) v1(35.1,31.19) v1(35.1,26.11) v1(35.1,21.03) v1(35.1,15.95) v1(35.1,0.71) v1(40.18,66.75) v1(40.18,61.67) v1(40.18,51.51) v1(40.18,26.11) v1(40.18,21.03) v1(40.18,5.79) v1(40.18,0.71) v1(45.26,92.15) v1(45.26,87.07) v1(45.26,76.91) v1(45.26,66.75) v1(45.26,61.67) v1(45.26,51.51) v1(45.26,41.35) v1(45.26,36.27) v1(45.26,31.19) v1(45.26,26.11) v1(45.26,21.03) v1(45.26,15.95) v1(45.26,5.79) v1(45.26,0.71) v1(50.34,87.07) v1(50.34,51.51) v1(50.34,41.35) v1(50.34,36.27) v1(50.34,31.19) v1(50.34,15.95) v1(50.34,5.79) v1(50.34,0.71) v1(55.42,92.15) v1(55.42,87.07) v1(55.42,76.91) v1(55.42,61.67) v1(55.42,51.51) v1(55.42,41.35) v1(55.42,36.27) v1(55.42,31.19) v1(55.42,26.11) v1(55.42,15.95) v1(55.42,5.79) v1(55.42,0.71) v1(60.5,92.15) v1(60.5,87.07) v1(60.5,76.91) v1(60.5,71.83) v1(60.5,66.75) v1(60.5,61.67) v1(60.5,51.51) v1(60.5,41.35) v1(60.5,36.27) v1(60.5,15.95) v1(60.5,5.79) v1(60.5,0.71) v1(65.58,92.15) v1(65.58,87.07) v1(65.58,61.67) v1(65.58,51.51) v1(65.58,46.43) v1(65.58,31.19) v1(65.58,26.11) v1(70.66,92.15) v1(70.66,87.07) v1(70.66,61.67) v1(70.66,51.51) v1(70.66,46.43) v1(70.66,41.35) v1(70.66,36.27) v1(70.66,15.95) v1(70.66,10.87) v1(70.66,5.79) v1(75.74,87.07) v1(75.74,61.67) v1(75.74,51.51) v1(75.74,46.43) v1(75.74,41.35) v1(75.74,36.27) v1(75.74,31.19) v1(75.74,26.11) v1(75.74,15.95) v1(80.82,92.15) v1(80.82,87.07) v1(80.82,76.91) v1(80.82,71.83) v1(80.82,61.67) v1(80.82,51.51) v1(80.82,46.43) v1(80.82,41.35) v1(80.82,36.27) v1(80.82,31.19) v1(80.82,26.11) v1(85.9,71.83) v1(85.9,61.67) v1(85.9,51.51) v1(85.9,46.43) v1(85.9,41.35) v1(85.9,36.27) v1(85.9,31.19) v1(85.9,26.11) v1(85.9,15.95) v1(85.9,5.79) v1(85.9,0.71) v1(90.98,97.23) v1(90.98,66.75) v1(90.98,61.67) v1(90.98,51.51) v1(90.98,46.43) v1(90.98,41.35) v1(90.98,36.27) v1(90.98,31.19) v1(90.98,26.11) v1(90.98,5.79) v1(90.98,0.71) v1(96.06,92.15) v1(96.06,87.07) v1(96.06,81.99) v1(96.06,76.91) v1(96.06,71.83) v1(96.06,66.75) v1(96.06,46.43) v1(96.06,41.35) v1(96.06,36.27) v1(96.06,26.11) v1(96.06,5.79) v1(96.06,0.71)
+5A: length 32.5
  Top Layer w0.635: +5V#2.5 +5V#2.4 +5V#2.3 +5V#2.2 73.91,9.93 ; +5V#2.5 84.33,10.2 U31.1 ; +5V#2.5 95.91,9.93 96.27,10.29 96.27,14.69 U32.1
-5A: length 31
  Top Layer w0.635: -5V#2.5 -5V#2.4 -5V#2.3 -5V#2.2 65.79,1.52 65.02,2.29 65.02,13.7 U30.2
$1N236: length 2.2
  Top Layer w0.762: U18.5 20.1,83.51 C8.1
$1N237: length 2.2
  Top Layer w0.762: C8.2 21.05,83.51 U18.6
$1N242: length 1.5
  Top Layer w0.254: LED4.2 29.41,83.08 R6.1
$1N715: length 2.3
  Top Layer w0.254: 13.91,32.13 13.91,32.58 14.15,32.82 U20.5
$1N716: length 2.6
  Top Layer w0.254: U20.10 19.54,33.82 C27.1
$1N717: length 2.6
  Top Layer w0.254: U20.9 19.43,33.32 C27.2
$1N728: length 7.5
  Top Layer w0.254: R29.1 14.56,37 14.73,36.83 14.73,34.67 15.08,34.32 U20.2
  Top Layer w0.381: 15.83,38.74 14.35,38.74 13.97,38.35 13.97,37.06 R29.1
$1N729: length 2.2
  Top Layer w0.381: U20.1 15.83,34.98 15.83,36.96
$1N734: length 3.8
  Top Layer w0.254: R28.1 R27.2 17.48,32.25 U20.7
$1N740: length 1.5
  Top Layer w0.254: LED3.2 11.86,28.32 R5.1
$1N1533: length 19.9
  Top Layer w0.762: U26.2 31.05,71.69 32.26,72.9 49.65,72.9 U25.2
$1N2930: length 46
  Top Layer w0.762: 88.77,95.63 91.06,93.34 U33.1 91.06,71.12 90.5,70.57 +5V.5 +5V.4 +5V.3 +5V.2 +5V.1 76.86,70.8 U34.1

## Copper pours and planes (outline as drawn; the poured copper is in the pictures)
+5V on Top Layer: 9.27,91.57 29.59,91.57 29.59,84.71 9.27,84.71
+5V on Top Layer: 3.05,35.69 15.88,35.69 15.88,32.77 3.05,32.77
-5VA on Top Layer: 12.45,32.51 31.24,32.51 31.24,14.31 12.45,14.31
-5VB on Top Layer: 20.7,88.65 26.92,88.65 26.92,74.67 20.7,74.67
GND on Top Layer: -20.7,132.97 108.08,132.97 108.08,-14.22 -20.7,-14.22
GND on Bottom Layer: -17.91,112.27 115.44,112.27 115.44,-20.32 -17.91,-20.32
+5A on Top Layer: 47.12,44.03 98.55,44.03 98.55,13.59 47.12,13.59
-5A on Top Layer: 59.69,20.96 69.22,20.96 69.22,12.32 59.69,12.32
-5A on Top Layer: 63.75,12.95 66.04,12.95 66.04,11.68 63.75,11.68
-5A on Top Layer: 46.74,22.99 96.01,22.99 96.01,13.6 46.74,13.6
-5B on Top Layer: 38.34,85.6 88.39,85.6 88.39,62.59 38.34,62.59
$1N844 on Top Layer: 28.45,42.8 41.28,42.8 41.28,30.99 28.45,30.99
$1N1353 on Top Layer: 32.64,14.22 41.53,14.22 41.53,6.22 32.64,6.22
$1N1533 on Top Layer: 29.72,73.93 51.86,73.93 51.86,70.74 29.72,70.74
$1N2930 on Top Layer: 31.22,96.9 90.3,96.9 90.3,93.73 31.22,93.73
$1N3122 on Top Layer: 48.51,71.76 59.82,71.76 59.82,63.75 48.51,63.75
$1N3165 on Top Layer: 38.87,47.88 60.5,47.88 60.5,45.87 38.87,45.87
$1N3204 on Top Layer: 38.73,11.68 61.85,11.68 61.85,8.25 38.73,8.25

Small or netless copper shapes (teardrops, artwork), in the pictures only: 1 on Top Layer

## Text on the board
Top Silkscreen Layer: IN+ | +5V | -5v
